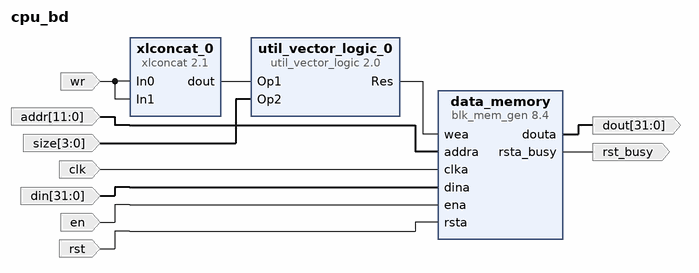
[diagram p0: block diagram of the top level]
# Vivado block design cpu_bd, xc7z020clg400-1, Vivado 2024.2
create_bd_design cpu_bd

create_bd_port -dir I -from 31 -to 0 din
create_bd_port -dir I -type clk clk
set_property -dict {CONFIG.ASSOCIATED_RESET rst} [get_bd_ports clk]
create_bd_port -dir I -from 11 -to 0 addr
create_bd_port -dir I -from 3 -to 0 size
create_bd_port -dir I -type rst rst
set_property -dict {CONFIG.POLARITY ACTIVE_HIGH} [get_bd_ports rst]
create_bd_port -dir I en
create_bd_port -dir O -from 31 -to 0 dout
create_bd_port -dir O rst_busy
create_bd_port -dir I -type data wr

create_bd_cell -type ip -vlnv xilinx.com:ip:blk_mem_gen:8.4 data_memory
set_property -dict [list \
  CONFIG.Algorithm Minimum_Area \
  CONFIG.Byte_Size 8 \
  CONFIG.Fill_Remaining_Memory_Locations true \
  CONFIG.Memory_Type Single_Port_RAM \
  CONFIG.Operating_Mode_A WRITE_FIRST \
  CONFIG.Register_PortA_Output_of_Memory_Core false \
  CONFIG.Register_PortA_Output_of_Memory_Primitives false \
  CONFIG.Use_Byte_Write_Enable true \
  CONFIG.Use_RSTA_Pin true \
  CONFIG.Write_Depth_A 4096 \
  CONFIG.Write_Width_A 32 \
  CONFIG.use_bram_block Stand_Alone \
] [get_bd_cells data_memory]
create_bd_cell -type ip -vlnv xilinx.com:ip:util_vector_logic:2.0 util_vector_logic_0
set_property -dict {CONFIG.C_SIZE 4} [get_bd_cells util_vector_logic_0]
create_bd_cell -type ip -vlnv xilinx.com:ip:xlconcat:2.1 xlconcat_0
set_property -dict {CONFIG.NUM_PORTS 4} [get_bd_cells xlconcat_0]

# ---- connections ----

connect_bd_net -net addra_0_1 [get_bd_ports addr] [get_bd_pins data_memory/addra]
connect_bd_net -net clka_0_1 [get_bd_ports clk] [get_bd_pins data_memory/clka]
connect_bd_net [get_bd_pins data_memory/douta] [get_bd_ports dout]
connect_bd_net [get_bd_pins data_memory/rsta_busy] [get_bd_ports rst_busy]
connect_bd_net -net dina_0_1 [get_bd_ports din] [get_bd_pins data_memory/dina]
connect_bd_net -net ena_0_1 [get_bd_ports en] [get_bd_pins data_memory/ena]
connect_bd_net -net rsta_0_1 [get_bd_ports rst] [get_bd_pins data_memory/rsta]
connect_bd_net [get_bd_ports size] [get_bd_pins util_vector_logic_0/Op2]
connect_bd_net [get_bd_pins util_vector_logic_0/Res] [get_bd_pins data_memory/wea]
connect_bd_net [get_bd_ports wr] [get_bd_pins xlconcat_0/In0] [get_bd_pins xlconcat_0/In1]
connect_bd_net [get_bd_pins xlconcat_0/dout] [get_bd_pins util_vector_logic_0/Op1]

validate_bd_design
save_bd_design
